# Altium project altium.PrjPcb
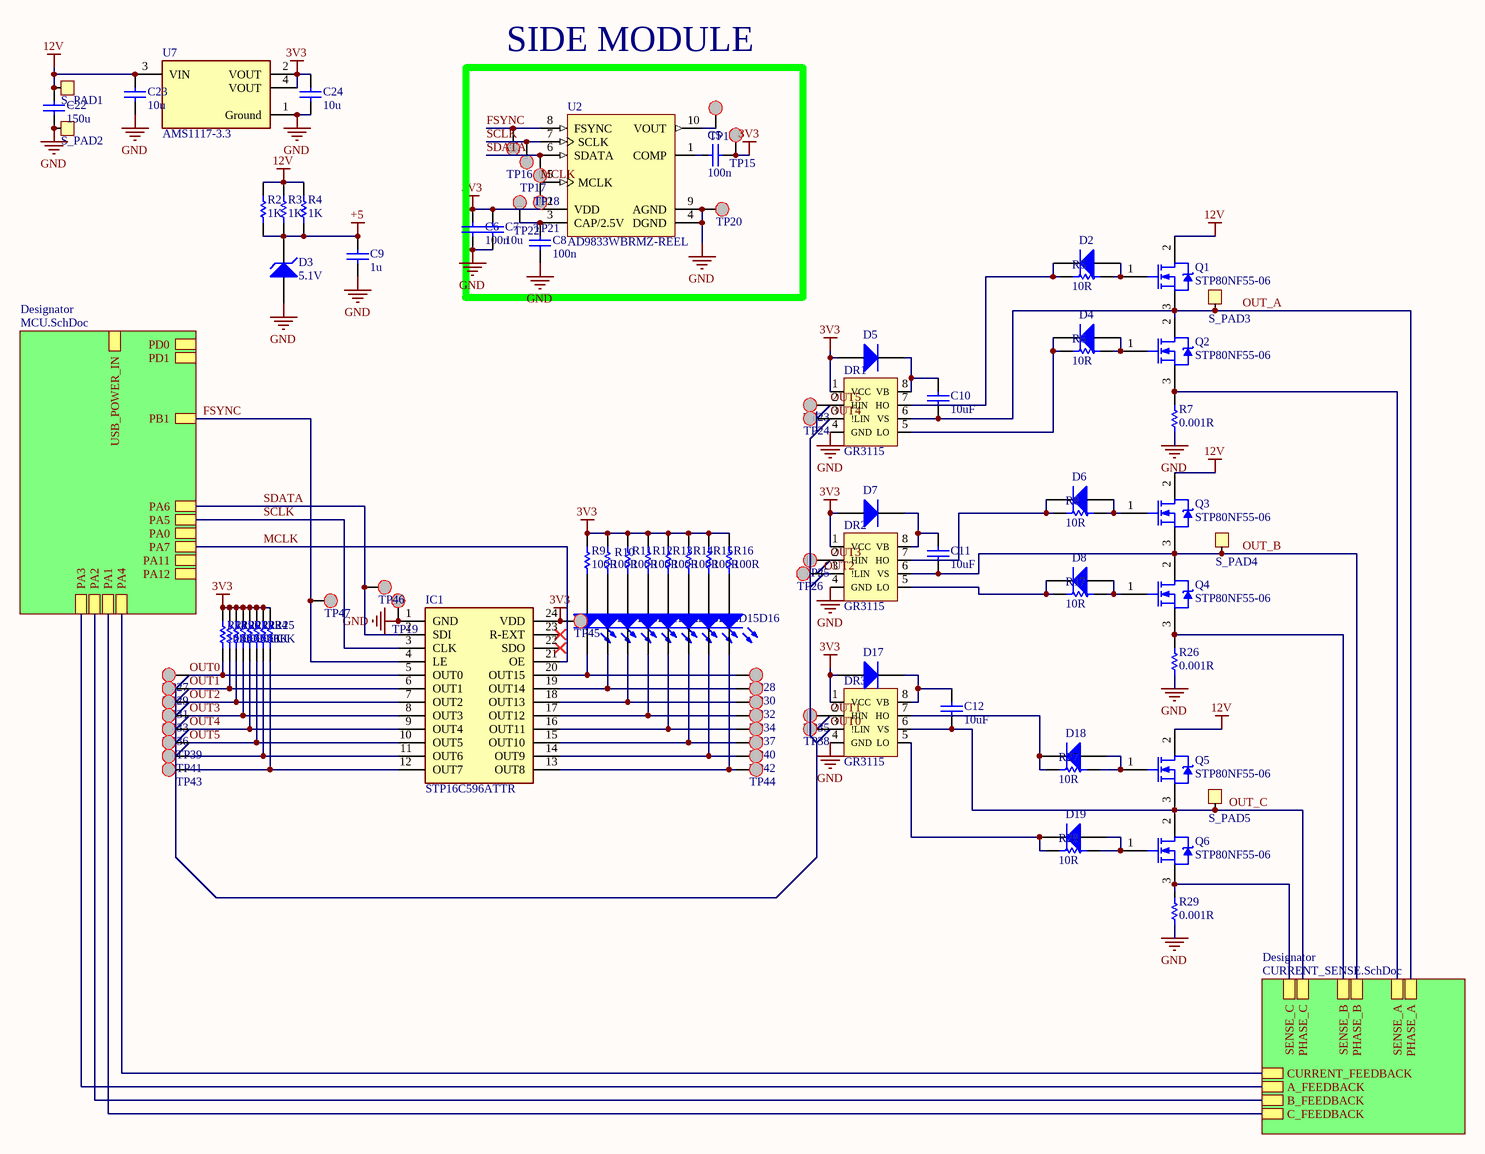
[diagram p0: MAIN_DRIVER.SchDoc]
3 sheets, 170 parts. Net scope: hierarchical (ports join the sheet entries above them; power ports are global).
Board file: MODULAR_PCB.PcbDoc
Sheets:
  MAIN_DRIVER.SchDoc
    Designator = MCU.SchDoc
    Designator = CURRENT_SENSE.SchDoc

## Sheet MAIN_DRIVER.SchDoc
size A3; SheetNumber: 1; SheetTotal: 3

### Parts
C5  value 100n  [CAP FILM 0603_1608]  (hidden comment: Capacitor)
C6  value 100n  [CAP FILM 0603_1608]  (hidden comment: Capacitor)
C7  value 10u  [CAP FILM 0603_1608]  (hidden comment: Capacitor)
C8  value 100n  [CAP FILM 0603_1608]  (hidden comment: Capacitor)
C9  value 1u  [CAP FILM 0603_1608]  (hidden comment: Capacitor)
C10  value 10uF  [CAP FILM 0603_1608]  (hidden comment: Capacitor)
C11  value 10uF  [CAP FILM 0603_1608]  (hidden comment: Capacitor)
C12  value 10uF  [CAP FILM 0603_1608]  (hidden comment: Capacitor)
C22  value 150u  [CAPAE7266X80M]  (hidden comment: Capacitor)
C23  value 10u  [CAP FILM 0805]  (hidden comment: Capacitor)
C24  value 10u  [CAP FILM 0805]  (hidden comment: Capacitor)
D2  1N4148  [SODFL375X135-2N]  (value not drawn)
D3  BV: 5.1V  [DIOMELF3514N]  (hidden comment: Zener Diode)
D4  1N4148  [SODFL375X135-2N]  (value not drawn)
D5  Diode  [SODFL365X110-2N]  (value not drawn)
D6  1N4148  [SODFL375X135-2N]  (value not drawn)
D7  Diode  [SODFL365X110-2N]  (value not drawn)
D8  1N4148  [SODFL375X135-2N]  (value not drawn)
D9  Light-Emitting Diode  [RES 0603_1608]  (value not drawn)
D10  Light-Emitting Diode  [RES 0603_1608]  (value not drawn)
D11  Light-Emitting Diode  [RES 0603_1608]  (value not drawn)
D12  Light-Emitting Diode  [RES 0603_1608]  (value not drawn)
D13  Light-Emitting Diode  [RES 0603_1608]  (value not drawn)
D14  Light-Emitting Diode  [RES 0603_1608]  (value not drawn)
D15  Light-Emitting Diode  [RES 0603_1608]  (value not drawn)
D16  Light-Emitting Diode  [RES 0603_1608]  (value not drawn)
D17  Diode  [SODFL365X110-2N]  (value not drawn)
D18  1N4148  [SODFL375X135-2N]  (value not drawn)
D19  1N4148  [SODFL375X135-2N]  (value not drawn)
DR1  GR3115  [PCBComponent_1]
DR2  GR3115  [PCBComponent_1]
DR3  GR3115  [PCBComponent_1]
IC1  STP16C596ATTR  [SOP65P638X110-24N]
Q1  STP80NF55-06  [STM-TO-220A-3]
Q2  STP80NF55-06  [STM-TO-220A-3]
Q3  STP80NF55-06  [STM-TO-220A-3]
Q4  STP80NF55-06  [STM-TO-220A-3]
Q5  STP80NF55-06  [STM-TO-220A-3]
Q6  STP80NF55-06  [STM-TO-220A-3]
R2  value 1K  [RES 0603_1608]  (hidden comment: Resistor)
R3  value 1K  [RES 0603_1608]  (hidden comment: Resistor)
R4  value 1K  [RES 0603_1608]  (hidden comment: Resistor)
R5  value 10R  [RES 0603_1608]  (hidden comment: Resistor)
R6  value 10R  [RES 0603_1608]  (hidden comment: Resistor)
R7  value 0.001R  [RES 1206_3216]  (hidden comment: Resistor)
R8  value 10R  [RES 0603_1608]  (hidden comment: Resistor)
R9  value 100R  [RES 0603_1608]  (hidden comment: Resistor)
R10  value 100R  [RES 0603_1608]  (hidden comment: Resistor)
R11  value 100R  [RES 0603_1608]  (hidden comment: Resistor)
R12  value 100R  [RES 0603_1608]  (hidden comment: Resistor)
R13  value 100R  [RES 0603_1608]  (hidden comment: Resistor)
R14  value 100R  [RES 0603_1608]  (hidden comment: Resistor)
R15  value 100R  [RES 0603_1608]  (hidden comment: Resistor)
R16  value 100R  [RES 0603_1608]  (hidden comment: Resistor)
R17  value 10R  [RES 0603_1608]  (hidden comment: Resistor)
R18  value 10K  [RES 0603_1608]  (hidden comment: Resistor)
R19  value 10K  [RES 0603_1608]  (hidden comment: Resistor)
R20  value 10K  [RES 0603_1608]  (hidden comment: Resistor)
R21  value 10K  [RES 0603_1608]  (hidden comment: Resistor)
R22  value 10K  [RES 0603_1608]  (hidden comment: Resistor)
R23  value 10K  [RES 0603_1608]  (hidden comment: Resistor)
R24  value 10K  [RES 0603_1608]  (hidden comment: Resistor)
R25  value 10K  [RES 0603_1608]  (hidden comment: Resistor)
R26  value 0.001R  [RES 1206_3216]  (hidden comment: Resistor)
R27  value 10R  [RES 0603_1608]  (hidden comment: Resistor)
R28  value 10R  [RES 0603_1608]  (hidden comment: Resistor)
R29  value 0.001R  [RES 1206_3216]  (hidden comment: Resistor)
S_PAD1  SOLDER_PAD  [POWER_PAD]  (value not drawn)
S_PAD2  SOLDER_PAD  [POWER_PAD]  (value not drawn)
S_PAD3  SOLDER_PAD  [POWER_PAD]  (value not drawn)
S_PAD4  SOLDER_PAD  [POWER_PAD]  (value not drawn)
S_PAD5  SOLDER_PAD  [POWER_PAD]  (value not drawn)
TP14  (no value)  [ROUND_SMALL]
TP15  (no value)  [ROUND_SMALL]
TP16  (no value)  [ROUND_SMALL]
TP17  (no value)  [ROUND_SMALL]
TP18  (no value)  [ROUND_SMALL]
TP19  (no value)  [ROUND_SMALL]
TP20  (no value)  [ROUND_SMALL]
TP21  (no value)  [ROUND_SMALL]
TP22  (no value)  [ROUND_SMALL]
TP23  (no value)  [ROUND_SMALL]
TP24  (no value)  [ROUND_SMALL]
TP25  (no value)  [ROUND_SMALL]
TP26  (no value)  [ROUND_SMALL]
TP27  (no value)  [ROUND_SMALL]
TP28  (no value)  [ROUND_SMALL]
TP29  (no value)  [ROUND_SMALL]
TP30  (no value)  [ROUND_SMALL]
TP31  (no value)  [ROUND_SMALL]
TP32  (no value)  [ROUND_SMALL]
TP33  (no value)  [ROUND_SMALL]
TP34  (no value)  [ROUND_SMALL]
TP35  (no value)  [ROUND_SMALL]
TP36  (no value)  [ROUND_SMALL]
TP37  (no value)  [ROUND_SMALL]
TP38  (no value)  [ROUND_SMALL]
TP39  (no value)  [ROUND_SMALL]
TP40  (no value)  [ROUND_SMALL]
TP41  (no value)  [ROUND_SMALL]
TP42  (no value)  [ROUND_SMALL]
TP43  (no value)  [ROUND_SMALL]
TP44  (no value)  [ROUND_SMALL]
TP45  (no value)  [ROUND_SMALL]
TP46  (no value)  [ROUND_SMALL]
TP47  (no value)  [ROUND_SMALL]
U2  AD9833WBRMZ-REEL  [ADI-RM-10_M]
U7  AMS1117-3.3  [FP-AMS1117-IPC_C]

### Blocks framed on the sheet
SIDE MODULE: C5-C8 TP14-TP18 TP20-TP22 U2

### Sub-sheets
Designator = MCU.SchDoc: USB_POWER_IN, PD0, PD1, PB1, PA5, PA6, PA7, PA11, PA12, PA1, PA2, PA3, PA4, PA0
Designator = CURRENT_SENSE.SchDoc: SENSE_A, SENSE_B, SENSE_C, PHASE_A, PHASE_B, PHASE_C, CURRENT_FEEDBACK, A_FEEDBACK, B_FEEDBACK, C_FEEDBACK

### Nets
3V3: C5.2 C6.2 C7.1 C24.2 D5.1(A) D7.1(A) D17.1(A) DR1.1(VCC) DR2.1(VCC) DR3.1(VCC) IC1.24(VDD) R9.2 R10.2 R11.2 R12.2 R13.2 R14.2 R15.2 R16.2 R18.2 R19.2 R20.2 R21.2 R22.2 R23.2 R24.2 R25.2 TP15.1(Test_Point) TP45.1(Test_Point) U2.2(VDD) U7.2(VOUT) U7.4(VOUT)
12V: C22.2 C23.2 Q1.2(D) Q3.2(D) Q5.2(D) R2.2 R3.2 R4.2 S_PAD1.1 U7.3(VIN)
+5: C9.2 D3.2(K) R2.1 R3.1 R4.1
GND: C6.1 C7.2 C8.1 C9.1 C22.1 C23.1 C24.1 D3.1(A) DR1.4(GND) DR2.4(GND) DR3.4(GND) IC1.1(GND) R7.1 R26.1 R29.1 S_PAD2.1 TP19.1(Test_Point) TP20.1(Test_Point) U2.4(DGND) U2.9(AGND) U7.1(Ground)
FSYNC: IC1.4(LE) TP16.1(Test_Point) TP47.1(Test_Point) U2.8(FSYNC) ; sheet Designator/PB1
MCLK: IC1.21(OE) TP21.1(Test_Point) U2.5(MCLK) ; sheet Designator/PA7
OUT0: DR3.3(!LIN) IC1.5(OUT0) R18.1 TP27.1(Test_Point) TP38.1(Test_Point)
OUT1: DR3.2(HIN) IC1.6(OUT1) R19.1 TP29.1(Test_Point) TP35.1(Test_Point)
OUT2: DR2.3(!LIN) IC1.7(OUT2) R20.1 TP26.1(Test_Point) TP31.1(Test_Point)
OUT3: DR2.2(HIN) IC1.8(OUT3) R21.1 TP25.1(Test_Point) TP33.1(Test_Point)
OUT4: DR1.3(!LIN) IC1.9(OUT4) R22.1 TP24.1(Test_Point) TP36.1(Test_Point)
OUT5: DR1.2(HIN) IC1.10(OUT5) R23.1 TP23.1(Test_Point) TP39.1(Test_Point)
OUT_A: C10.1 DR1.6(VS) Q1.3(S) Q2.2(D) S_PAD3.1 ; sheet Designator/PHASE_A
OUT_B: C11.2 DR2.6(VS) Q3.3(S) Q4.2(D) S_PAD4.1 ; sheet Designator/PHASE_B
OUT_C: C12.1 DR3.6(VS) Q5.3(S) Q6.2(D) S_PAD5.1 ; sheet Designator/PHASE_C
SCLK: IC1.3(CLK) TP17.1(Test_Point) U2.7(SCLK) ; sheet Designator/PA5
SDATA: IC1.2(SDI) TP18.1(Test_Point) TP46.1(Test_Point) U2.6(SDATA) ; sheet Designator/PA6
NetB1_7: sheet Designator/PA1, sheet Designator/C_FEEDBACK
NetB1_8: sheet Designator/PA2, sheet Designator/B_FEEDBACK
NetB1_9: sheet Designator/PA3, sheet Designator/A_FEEDBACK
NetB1_10: sheet Designator/PA4, sheet Designator/CURRENT_FEEDBACK
NetC5_1: C5.1 U2.1(COMP)
NetC8_2: C8.2 TP22.1(Test_Point) U2.3(CAP/2.5V)
NetC10_2: C10.2 D5.2(K) DR1.8(VB)
NetC11_1: C11.1 D7.2(K) DR2.8(VB)
NetC12_2: C12.2 D17.2(K) DR3.8(VB)
NetD2_1: D2.1(A) Q1.1(G) R5.2
NetD2_2: D2.2(K) DR1.7(HO) R5.1
NetD4_1: D4.1(A) Q2.1(G) R6.2
NetD4_2: D4.2(K) DR1.5(LO) R6.1
NetD6_1: D6.1(A) Q3.1(G) R8.2
NetD6_2: D6.2(K) DR2.7(HO) R8.1
NetD8_1: D8.1(A) Q4.1(G) R17.2
NetD8_2: D8.2(K) DR2.5(LO) R17.1
NetD9_1: D9.1(A) R9.1
NetD9_2: D9.2(K) IC1.20(OUT15) TP28.1(Test_Point)
NetD10_1: D10.1(A) R10.1
NetD10_2: D10.2(K) IC1.19(OUT14) TP30.1(Test_Point)
NetD11_1: D11.1(A) R11.1
NetD11_2: D11.2(K) IC1.18(OUT13) TP32.1(Test_Point)
NetD12_1: D12.1(A) R12.1
NetD12_2: D12.2(K) IC1.17(OUT12) TP34.1(Test_Point)
NetD13_1: D13.1(A) R13.1
NetD13_2: D13.2(K) IC1.16(OUT11) TP37.1(Test_Point)
NetD14_1: D14.1(A) R14.1
NetD14_2: D14.2(K) IC1.15(OUT10) TP40.1(Test_Point)
NetD15_1: D15.1(A) R15.1
NetD15_2: D15.2(K) IC1.14(OUT9) TP42.1(Test_Point)
NetD16_1: D16.1(A) R16.1
NetD16_2: D16.2(K) IC1.13(OUT8) TP44.1(Test_Point)
NetD18_1: D18.1(A) Q5.1(G) R27.2
NetD18_2: D18.2(K) DR3.7(HO) R27.1
NetD19_1: D19.1(A) Q6.1(G) R28.2
NetD19_2: D19.2(K) DR3.5(LO) R28.1
NetIC1_11: IC1.11(OUT6) R24.1 TP41.1(Test_Point)
NetIC1_12: IC1.12(OUT7) R25.1 TP43.1(Test_Point)
NetQ2_3: Q2.3(S) R7.2 ; sheet Designator/SENSE_A
NetQ4_3: Q4.3(S) R26.2 ; sheet Designator/SENSE_B
NetQ6_3: Q6.3(S) R29.2 ; sheet Designator/SENSE_C
NetTP14_1: TP14.1(Test_Point) U2.10(VOUT)

Not connected (* = marked no-connect by the designer): IC1 22(SDO)* 23(R-EXT)*

### Library data of the parts
C5-C12 C22-C24 = Capacitor: SimulationGenericComponent: True
D2 D4-D8 D17-D19 = Diode: AF: 1; BV: 0; BV_MAX: 1e99; EG: 1.11; FC: 0.5; IBV: 0.001; ISR: 1e-14; MJSW: 0.33; NTUN: 30; TNOM: 27; XTI: 3; SimulationGenericComponent: True; CJO: 0; CJP: 0; CTA: 0; CTP: 0; FCS: 0.5; FV_MAX: 1e99; IKF: 0; IKR: 0; JSW: 0; JTUN: 0; JTUNSW: 0; KEG: 1; KF: 0; LEVEL: 1; N: 1; NBV: 1; NR: 1; NS: 1; PHP: 1; RS: 0; TCV: 0; TLEV: 0; TLEVC: 0; TM1: 0; TM2: 0; TPB: 0; TPHP: 0; TRS: 0; TRS2: 0; TT: 0; TTT1: 0; TTT2: 0; VJ: 1; XTITUN: 3; IS: 1e-14
D3 = Zener Diode: AF: 1; BV_MAX: 1e99; CJO: 0; EG: 1.11; FC: 0.5; IBV: 0.001; IS: 1e-14; MJSW: 0.33; NTUN: 30; TNOM: 27; XTI: 3; SimulationGenericComponent: True; CJP: 0; CTA: 0; CTP: 0; FCS: 0.5; FV_MAX: 1e99; IKF: 0; IKR: 0; ISR: 1e-14; JSW: 0; JTUN: 0; JTUNSW: 0; KEG: 1; KF: 0; LEVEL: 1; N: 1; NBV: 1; NR: 1; NS: 1; PHP: 1; RS: 0; TCV: 0; TLEV: 0; TLEVC: 0; TM1: 0; TM2: 0; TPB: 0; TPHP: 0; TRS: 0; TRS2: 0; TT: 0; TTT1: 0; TTT2: 0; VJ: 1; XTITUN: 3
D9-D16 = LED: AF: 1; BV: 0; BV_MAX: 1e99; EG: 1.11; FC: 0.5; IBV: 0.001; IS: 1e-14; MJSW: 0.33; NTUN: 30; TNOM: 27; XTI: 3; SimulationGenericComponent: True; CJO: 0; CJP: 0; CTA: 0; CTP: 0; FCS: 0.5; FV_MAX: 1e99; IKF: 0; IKR: 0; ISR: 1e-14; JSW: 0; JTUN: 0; JTUNSW: 0; KEG: 1; KF: 0; LEVEL: 1; N: 1; NBV: 1; NR: 1; NS: 1; PHP: 1; RS: 0; TCV: 0; TLEV: 0; TLEVC: 0; TM1: 0; TM2: 0; TPB: 0; TPHP: 0; TRS: 0; TRS2: 0; TT: 0; TTT1: 0; TTT2: 0; VJ: 1; XTITUN: 3
IC1 = STP16C596ATTR: Integrated Circuit; Manufacturer_Name: STMicroelectronics; Datasheet Link: https://www.st.com/resource/en/datasheet/cd00005085.pdf; Height: 1.1mm; Manufacturer_Part_Number: STP16C596ATTR; Mouser Part Number: N/A; Mouser Price/Stock: https://www.mouser.co.uk/ProductDetail/STMicroelectronics/STP16C596ATTR?qs=y2Ae8b0edtM6tyumk2sS7g%3D%3D
Q1-Q6 = CMP-2000-07168-1: N-Channel STripFET(TM) II Power MOSFET, 55 V, 80 A, 5 mOhm, -55 to 175 degC, 3-Pin TO-220, RoHS, Tube; Manufacturer: STMicroelectronics; Minimum Gate Threshold Voltage: 2V; Maximum Gate Threshold Voltage: 4V; Channel Type: N; Maximum Drain Source Voltage: 55V; Transistor Configuration: Single; Maximum Drain Source Resistance: 0.007Ω; Number of Elements per Chip: 1; Maximum Continuous Drain Current: 80A; Typical Gate Charge @ Vgs: 142nC@10V; Channel Mode: Enhancement; Typical Turn-Off Delay Time: 125ns; Maximum Gate Source Voltage: ±20V; Transistor Material: Si; Maximum Power Dissipation: 300W; Typical Input Capacitance @ Vds: 4400pF@25V; Typical Turn-On Delay Time: 27ns; Length: 10.4mm; Datasheet Version: Rev. 8, 10/2006; Package Type: TO-220; Minimum Operating Temperature: -55°C; Pin Count: 3; Package Description: 3-Pin Transistor Outline Package, 10.2 x 4.5 mm, Pitch 2.55 mm; Mounting Type: ThroughHole; Datasheet URL: http://www.st.com/content/ccc/resource/technical/document/datasheet/f1/46/49/9e/39/8f/49/aa/CD00002670.pdf/files/CD00002670.pdf/jcr:content/translations/en.CD00002670.pdf; Manufacturer URL: http://www.st.com/; Package URL: http://www.st.com/st-web-ui/static/active/en/resource/technical/document/datasheet/CD00000544.pdf; Height: 9.15mm; Width: 4.6mm; Dimensions: 10.4x4.6x9.15mm; Maximum Operating Temperature: +175°C; Category: PowerMOSFET; Package Reference: TO-220; Mounting Technology: ThroughHole
R2-R29 = Resistor: TC1: 0; SimulationGenericComponent: True; TC2: 0
TP14-TP47 = TEST_PAD
U2 = CMP-0293-00078-1: Low Power, 12.65 mW, 2.3 V to 5.5 V, Programmable Waveform Generator, 10-Bit, Serial, RM-10, 3000 Reel, Pb-Free; Master fclk: 25MHz; Tuning Word Width (bits): 28bit; FS Iout (mA nom): 3mA; REFCLK Multiplier: No; Compliance Range (V): 650mV; Resolution (Bits): 10bit; I Supply total (max): 5.5mA; I/O Interface: Serial; ComponentLink3Description: Package Specification; Code_JEDEC: MO-187-BA; ComponentLink2URL: http://www.analog.com/static/imported-files/data_sheets/AD9833.pdf; PackageReference: RM-10; ComponentLink3URL: http://www.analog.com/static/imported-files/packages/PKG_PDF/MSOP%28RM%29/RM_10.pdf; ComponentLink1URL: www.analog.com; DatasheetVersion: Rev. D; PackageVersion: 5/8/2005; ComponentLink2Description: Datasheet; ComponentLink1Description: Manufacturer URL; PackageDescription: 10-Lead Mini Small Outline Package [MSOP]
U7 = CMP-209535-000001-1: LDO Voltage Regulators 1A, 3.3V; Manufacturer: Advanced Monolithic Systems; Dropout Voltage: 1.1V; Output Type: Fixed; Nominal Supply Current: 5mA; Max Power Dissipation: 1.2W; Max Supply Voltage: 15V; Number Of Outputs: 1; Standoff Height: 0.64mm; Max Junction Temp: +125°C; Height: 1.8mm; Package: AMS1117; Device Class L2: Power Management ICs; ComponentLink2Description: Datasheet; ComponentLink2URL: http://www.advanced-monolithic.com/pdf/ds1117.pdf; Category: IC; RoHS: TRUE; Automotive: No; Device Class L1: Integrated Circuits (ICs); Output Current: 1A; Device Class L3: Voltage Regulators - Linear; Temperature: -40°C to +125°C; Output Voltage: 3.3V; Manufacturer Part Number: AMS1117-3.3; Temperature Range Low: -40°C; Octopart: https://octopart.com/ams1117-3.3-advanced+monolithic+systems-25899300; Lead Free: Yes; Ipc Land Pattern Name: SOT229P700X180-4; Temperature Range High: +125°C

## Sheet MCU.SchDoc
size A4; SheetNumber: 2; SheetTotal: 3
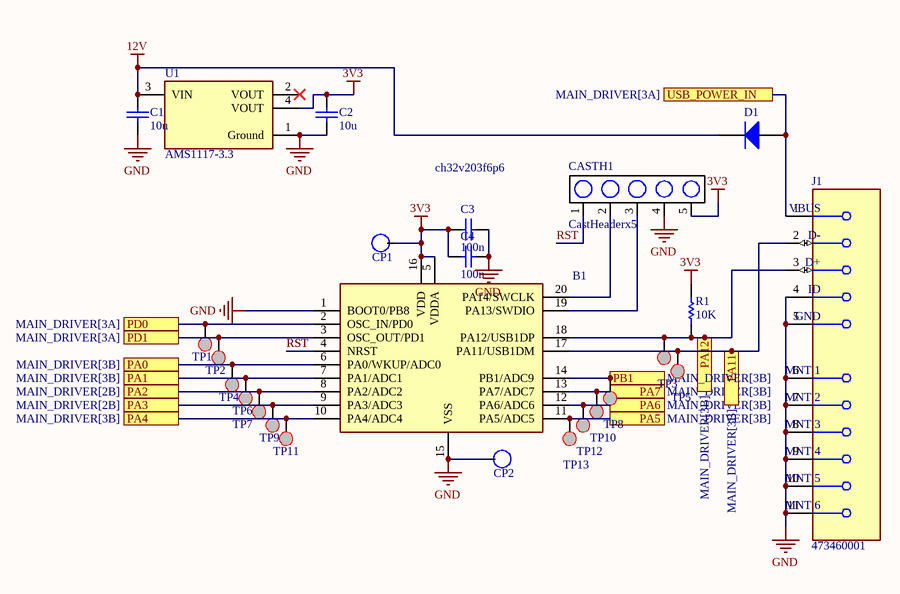
[diagram p1: MCU.SchDoc]

### Parts
B1  ch32v203f6p6  [SOP65P640X110-20N]
C1  value 10u  [CAP FILM 0603_1608]  (hidden comment: Capacitor)
C2  value 10u  [CAP FILM 0603_1608]  (hidden comment: Capacitor)
C3  value 100n  [SMD-0603-RES]  (hidden comment: Capacitor)
C4  value 100n  [SMD-0603-RES]  (hidden comment: Capacitor)
CASTH1  CastHeaderx5  [CASTHEADERX5]
CP1  CONNECT_PAD  [PAD_SQUARE]  (value not drawn)
CP2  CONNECT_PAD  [PAD_SQUARE]  (value not drawn)
D1  FR107  [SODFL365X110-2N]  (value not drawn)
J1  473460001  [FP-473460001-MFG]
R1  value 10K  [SMD-0603-RES]  (hidden comment: Resistor)
TP1  (no value)  [ROUND_SMALL]
TP2  (no value)  [ROUND_SMALL]
TP3  (no value)  [ROUND_SMALL]
TP4  (no value)  [ROUND_SMALL]
TP5  (no value)  [ROUND_SMALL]
TP6  (no value)  [ROUND_SMALL]
TP7  (no value)  [ROUND_SMALL]
TP8  (no value)  [ROUND_SMALL]
TP9  (no value)  [ROUND_SMALL]
TP10  (no value)  [ROUND_SMALL]
TP11  (no value)  [ROUND_SMALL]
TP12  (no value)  [ROUND_SMALL]
TP13  (no value)  [ROUND_SMALL]
U1  AMS1117-3.3  [FP-AMS1117-IPC_C]

### Ports
PA0 (see MAIN_DRIVER[3B]), PA1 (see MAIN_DRIVER[3B]), PA2 (see MAIN_DRIVER[2B]), PA3 (see MAIN_DRIVER[2B]), PA4 (see MAIN_DRIVER[3B]), PA5 (see MAIN_DRIVER[3B]), PA6 (see MAIN_DRIVER[3B]), PA7 (see MAIN_DRIVER[3B]), PA11 (see MAIN_DRIVER[3B]), PA12 (see MAIN_DRIVER[3B]), PB1 (see MAIN_DRIVER[3B]), PD0 (see MAIN_DRIVER[3A]), PD1 (see MAIN_DRIVER[3A]), USB_POWER_IN (see MAIN_DRIVER[3A])

### Nets
3V3: B1.5(VDDA) B1.16(VDD) C2.2 C3.1 C4.1 CASTH1.5 CP1.1 R1.2 U1.4(VOUT)
12V: C1.2 D1.2(K) U1.3(VIN)
GND: B1.1(BOOT0/PB8) B1.15(VSS) C1.1 C2.1 C3.2 C4.2 CASTH1.4 CP2.1 J1.4(ID) J1.5(GND) J1.6(MNT_1) J1.7(MNT_2) J1.8(MNT_3) J1.9(MNT_4) J1.10(MNT_5) J1.11(MNT_6) U1.1(Ground)
FSYNC: B1.14(PB1/ADC9) TP8.1(Test_Point) ; port PB1
MCLK: B1.13(PA7/ADC7) TP10.1(Test_Point) ; port PA7
RST: B1.4(NRST) CASTH1.1
SCLK: B1.11(PA5/ADC5) TP13.1(Test_Point) ; port PA5
SDATA: B1.12(PA6/ADC6) TP12.1(Test_Point) ; port PA6
NetB1_2: B1.2(OSC_IN/PD0) TP1.1(Test_Point) ; port PD0
NetB1_3: B1.3(OSC_OUT/PD1) TP2.1(Test_Point) ; port PD1
NetB1_6: B1.6(PA0/WKUP/ADC0) TP4.1(Test_Point) ; port PA0
NetB1_7: B1.7(PA1/ADC1) TP6.1(Test_Point) ; port PA1
NetB1_8: B1.8(PA2/ADC2) TP7.1(Test_Point) ; port PA2
NetB1_9: B1.9(PA3/ADC3) TP9.1(Test_Point) ; port PA3
NetB1_10: B1.10(PA4/ADC4) TP11.1(Test_Point) ; port PA4
NetB1_17: B1.17(PA11/USB1DM) J1.2(D+) TP5.1(Test_Point) ; port PA11
NetB1_18: B1.18(PA12/USB1DP) J1.3(D-) R1.1 TP3.1(Test_Point) ; port PA12
NetB1_19: B1.19(PA13/SWDIO) CASTH1.3
NetB1_20: B1.20(PA14/SWCLK) CASTH1.2
NetD1_1: D1.1(A) J1.1(VBUS) ; port USB_POWER_IN

Not connected (* = marked no-connect by the designer): U1 2(VOUT)*

### Library data of the parts
B1 = ch32v203f6p6: 144MHz, Industrial-grade general-purpose microcontrollers TSSOP20 Package; Manufacturer_Name: WCH; Geometry.Height: 1.1mm; Manufacturer_Part_Number: ch32v203f6p6; Mouser Part Number: *; Mouser Price/Stock: *; Arrow Part Number: *; Arrow Price/Stock: *; Datasheet Link: https://data.electronshik.ru/z/Datasheet/C/CH32V203K8T6.PDF
C1-C4 = Capacitor: SimulationGenericComponent: True
D1 = Diode: as D2 on sheet MAIN_DRIVER; CJO: 0; CJP: 0; CTA: 0; CTP: 0; FCS: 0.5; FV_MAX: 1e99; IKF: 0; IKR: 0; JSW: 0; JTUN: 0; JTUNSW: 0; KEG: 1; KF: 0; LEVEL: 1; N: 1; NBV: 1; NR: 1; NS: 1; PHP: 1; RS: 0; TCV: 0; TLEV: 0; TLEVC: 0; TM1: 0; TM2: 0; TPB: 0; TPHP: 0; TRS: 0; TRS2: 0; TT: 0; TTT1: 0; TTT2: 0; VJ: 1; XTITUN: 3; IS: 1e-14
J1 = CMP-2000-05246-2: CONN RCPT USB2.0 MICRO B SMD R/A; Manufacturer: Molex; Conn Orientation: Right Angle; Is Female: yes; Shielding: true; Pitch: 0.65mm; Number Of Contacts: 5; Voltage Rating: 30V; Current Rating: 1.8A; Device Class L2: USB Connectors; Digikey Description: CONN RCPT USB2.0 MICRO B SMD R/A; Height: 2.945mm; RoHS: TRUE; ComponentLink2Description: Datasheet; Octopart: https://octopart.com/47346-0001-molex-7164928; Automotive: No; Package: 0; Category: Conn; Device Class L1: Connectors; Usb Standard: USB 2.0; Temperature: -30°C to +85°C; Temperature Range Low: -30°C; Footprint Url: https://www.molex.com/pdm_docs/sd/473460001_sd.pdf; ComponentLink2URL: https://www.molex.com/webdocs/datasheets/pdf/en-us/0473460001_IO_CONNECTORS.pdf; Lead Free: Yes; Manufacturer Part Number: 473460001; Contact Material: Gold,Nickel; Temperature Range High: +85°C; Device Class L3: unset
R1 = Resistor: TC1: 0; SimulationGenericComponent: True; TC2: 0
TP1-TP13 = TEST_PAD
U1 = CMP-209535-000001-1: as U7 on sheet MAIN_DRIVER; Height: 1.8mm; Package: AMS1117; Device Class L2: Power Management ICs; ComponentLink2Description: Datasheet; ComponentLink2URL: http://www.advanced-monolithic.com/pdf/ds1117.pdf; Category: IC; RoHS: TRUE; Automotive: No; Device Class L1: Integrated Circuits (ICs); Output Current: 1A; Device Class L3: Voltage Regulators - Linear; Temperature: -40°C to +125°C; Output Voltage: 3.3V; Manufacturer Part Number: AMS1117-3.3; Temperature Range Low: -40°C; Octopart: https://octopart.com/ams1117-3.3-advanced+monolithic+systems-25899300; Lead Free: Yes; Ipc Land Pattern Name: SOT229P700X180-4; Temperature Range High: +125°C

## Sheet CURRENT_SENSE.SchDoc
size A4; SheetNumber: 3; SheetTotal: 3
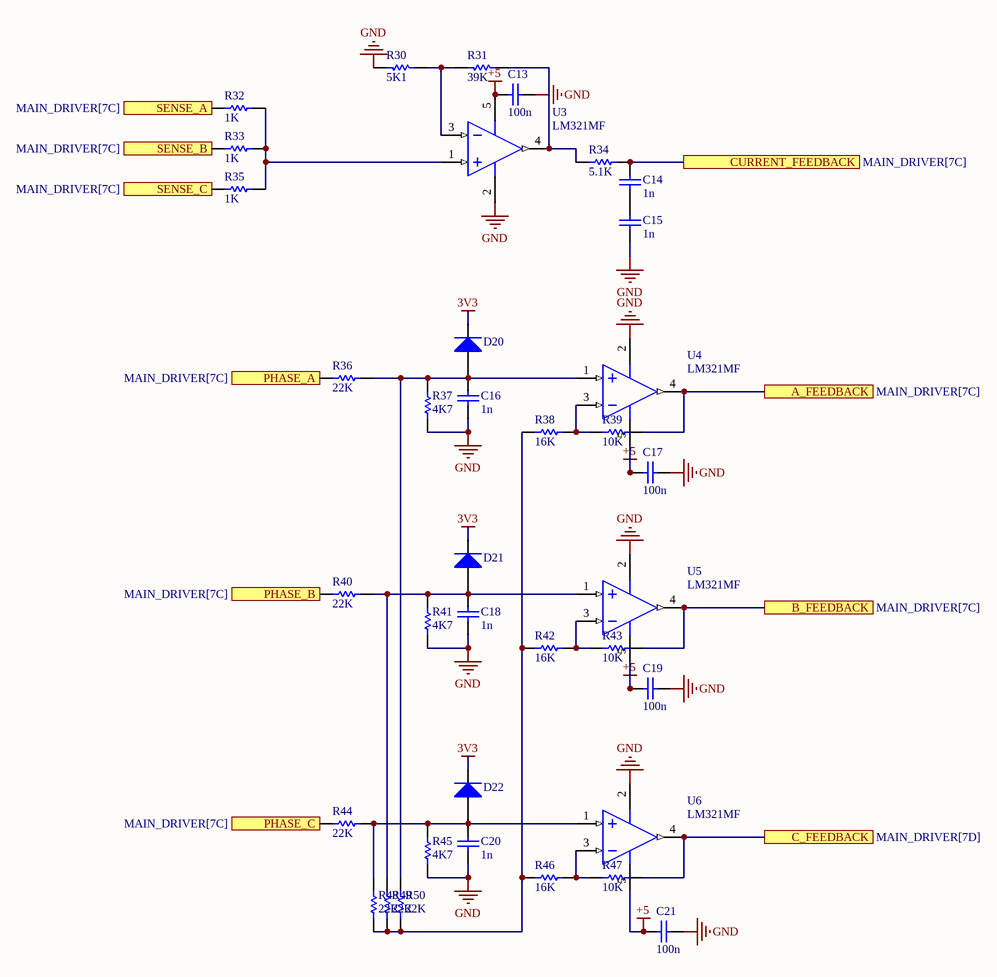
[diagram p2: CURRENT_SENSE.SchDoc]

### Parts
C13  value 100n  [CAP FILM 0603_1608]  (hidden comment: Capacitor)
C14  value 1n  [CAP FILM 0603_1608]  (hidden comment: Capacitor)
C15  value 1n  [CAP FILM 0603_1608]  (hidden comment: Capacitor)
C16  value 1n  [CAP FILM 0603_1608]  (hidden comment: Capacitor)
C17  value 100n  [CAP FILM 0603_1608]  (hidden comment: Capacitor)
C18  value 1n  [CAP FILM 0603_1608]  (hidden comment: Capacitor)
C19  value 100n  [CAP FILM 0603_1608]  (hidden comment: Capacitor)
C20  value 1n  [CAP FILM 0603_1608]  (hidden comment: Capacitor)
C21  value 100n  [CAP FILM 0603_1608]  (hidden comment: Capacitor)
D20  1N4148W  [SODFL375X135-2N]  (value not drawn)
D21  1N4148W  [SODFL375X135-2N]  (value not drawn)
D22  1N4148W  [SODFL375X135-2N]  (value not drawn)
R30  value 5K1  [RES 0603_1608 RF]  (hidden comment: Resistor)
R31  value 39K  [RES 0603_1608 RF]  (hidden comment: Resistor)
R32  value 1K  [RES 0603_1608 RF]  (hidden comment: Resistor)
R33  value 1K  [RES 0603_1608 RF]  (hidden comment: Resistor)
R34  value 5.1K  [RES 0603_1608 RF]  (hidden comment: Resistor)
R35  value 1K  [RES 0603_1608 RF]  (hidden comment: Resistor)
R36  value 22K  [RES 0603_1608 RF]  (hidden comment: Resistor)
R37  value 4K7  [RES 0603_1608 RF]  (hidden comment: Resistor)
R38  value 16K  [RES 0603_1608 RF]  (hidden comment: Resistor)
R39  value 10K  [RES 0603_1608 RF]  (hidden comment: Resistor)
R40  value 22K  [RES 0603_1608 RF]  (hidden comment: Resistor)
R41  value 4K7  [RES 0603_1608 RF]  (hidden comment: Resistor)
R42  value 16K  [RES 0603_1608 RF]  (hidden comment: Resistor)
R43  value 10K  [RES 0603_1608 RF]  (hidden comment: Resistor)
R44  value 22K  [RES 0603_1608 RF]  (hidden comment: Resistor)
R45  value 4K7  [RES 0603_1608 RF]  (hidden comment: Resistor)
R46  value 16K  [RES 0603_1608 RF]  (hidden comment: Resistor)
R47  value 10K  [RES 0603_1608 RF]  (hidden comment: Resistor)
R48  value 22K  [RES 0603_1608 RF]  (hidden comment: Resistor)
R49  value 22K  [RES 0603_1608 RF]  (hidden comment: Resistor)
R50  value 22K  [RES 0603_1608 RF]  (hidden comment: Resistor)
U3  LM321MF  [DBV0005A_L]
U4  LM321MF  [DBV0005A_L]
U5  LM321MF  [DBV0005A_L]
U6  LM321MF  [DBV0005A_L]

### Ports
A_FEEDBACK (see MAIN_DRIVER[7C]), B_FEEDBACK (see MAIN_DRIVER[7C]), C_FEEDBACK (see MAIN_DRIVER[7D]), CURRENT_FEEDBACK (see MAIN_DRIVER[7C]), PHASE_A (see MAIN_DRIVER[7C]), PHASE_B (see MAIN_DRIVER[7C]), PHASE_C (see MAIN_DRIVER[7C]), SENSE_A (see MAIN_DRIVER[7C]), SENSE_B (see MAIN_DRIVER[7C]), SENSE_C (see MAIN_DRIVER[7C])

### Nets
3V3: D20.2(K) D21.2(K) D22.2(K)
+5: C13.1 C17.1 C19.1 C21.1 U3.5(V+) U4.5(V+) U5.5(V+) U6.5(V+)
GND: C13.2 C15.1 C16.1 C17.2 C18.1 C19.2 C20.1 C21.2 R30.2 R37.1 R41.1 R45.1 U3.2(V-) U4.2(V-) U5.2(V-) U6.2(V-)
OUT_A: R36.1 ; port PHASE_A
OUT_B: R40.1 ; port PHASE_B
OUT_C: R44.1 ; port PHASE_C
NetB1_7: R47.2 U6.4(OUT) ; port C_FEEDBACK
NetB1_8: R43.2 U5.4(OUT) ; port B_FEEDBACK
NetB1_9: R39.2 U4.4(OUT) ; port A_FEEDBACK
NetB1_10: C14.2 R34.2 ; port CURRENT_FEEDBACK
NetC14_1: C14.1 C15.2
NetC16_2: C16.2 D20.1(A) R36.2 R37.2 R50.2 U4.1(IN+)
NetC18_2: C18.2 D21.1(A) R40.2 R41.2 R49.2 U5.1(IN+)
NetC20_2: C20.2 D22.1(A) R44.2 R45.2 R48.2 U6.1(IN+)
NetQ2_3: R32.1 ; port SENSE_A
NetQ4_3: R33.1 ; port SENSE_B
NetQ6_3: R35.1 ; port SENSE_C
NetR30_1: R30.1 R31.1 U3.3(IN-)
NetR31_2: R31.2 R34.1 U3.4(OUT)
NetR32_2: R32.2 R33.2 R35.2 U3.1(IN+)
NetR38_1: R38.1 R42.1 R46.1 R48.1 R49.1 R50.1
NetR38_2: R38.2 R39.1 U4.3(IN-)
NetR42_2: R42.2 R43.1 U5.3(IN-)
NetR46_2: R46.2 R47.1 U6.3(IN-)

### Library data of the parts
C13-C21 = Capacitor: SimulationGenericComponent: True
D20-D22 = Diode: as D2 on sheet MAIN_DRIVER; CJO: 0; CJP: 0; CTA: 0; CTP: 0; FCS: 0.5; FV_MAX: 1e99; IKF: 0; IKR: 0; JSW: 0; JTUN: 0; JTUNSW: 0; KEG: 1; KF: 0; LEVEL: 1; N: 1; NBV: 1; NR: 1; NS: 1; PHP: 1; RS: 0; TCV: 0; TLEV: 0; TLEVC: 0; TM1: 0; TM2: 0; TPB: 0; TPHP: 0; TRS: 0; TRS2: 0; TT: 0; TTT1: 0; TTT2: 0; VJ: 1; XTITUN: 3; IS: 1e-14
R30-R50 = Resistor: TC1: 0; SimulationGenericComponent: True; TC2: 0
U3-U6 = CMP-0055-01325-3: Low Power Single Op Amp, 5-pin SOT-23; Manufacturer: Texas Instruments; PackageTopMarking: A63A*XTT; CompType: Amplifiers; PowerWise: N; ComponentLink1URL: http://www.ti.com/general/docs/lit/getliterature.tsp?genericPartNumber=LM321&fileType=pdf; PinCount: 5; RoHS: N; ComponentLink1Description: Datasheet URL; Package Reference: DBV0005A; PackageDescription: Molded SOT-23, .115 x .063 x .040 in Body, 5 Lead, .0375 in Pitch

## Nets that join several sheets
3V3: MAIN_DRIVER (32 pins), MCU (9 pins), CURRENT_SENSE (D20.2 D21.2 D22.2)
12V: MAIN_DRIVER (10 pins), MCU (C1.2 D1.2 U1.3)
+5: MAIN_DRIVER (5 pins), CURRENT_SENSE (8 pins)
GND: MAIN_DRIVER (21 pins), MCU (17 pins), CURRENT_SENSE (16 pins)
FSYNC: MAIN_DRIVER (IC1.4 TP16.1 TP47.1 U2.8), MCU (B1.14 TP8.1)
MCLK: MAIN_DRIVER (IC1.21 TP21.1 U2.5), MCU (B1.13 TP10.1)
NetB1_7: MCU (B1.7 TP6.1), CURRENT_SENSE (R47.2 U6.4)
NetB1_8: MCU (B1.8 TP7.1), CURRENT_SENSE (R43.2 U5.4)
NetB1_9: MCU (B1.9 TP9.1), CURRENT_SENSE (R39.2 U4.4)
NetB1_10: MCU (B1.10 TP11.1), CURRENT_SENSE (C14.2 R34.2)
NetQ2_3: MAIN_DRIVER (Q2.3 R7.2), CURRENT_SENSE (R32.1)
NetQ4_3: MAIN_DRIVER (Q4.3 R26.2), CURRENT_SENSE (R33.1)
NetQ6_3: MAIN_DRIVER (Q6.3 R29.2), CURRENT_SENSE (R35.1)
OUT_A: MAIN_DRIVER (5 pins), CURRENT_SENSE (R36.1)
OUT_B: MAIN_DRIVER (5 pins), CURRENT_SENSE (R40.1)
OUT_C: MAIN_DRIVER (5 pins), CURRENT_SENSE (R44.1)
SCLK: MAIN_DRIVER (IC1.3 TP17.1 U2.7), MCU (B1.11 TP13.1)
SDATA: MAIN_DRIVER (IC1.2 TP18.1 TP46.1 U2.6), MCU (B1.12 TP12.1)